# EAGLE design breadboard-small-with-header (EAGLE 6.5.0)
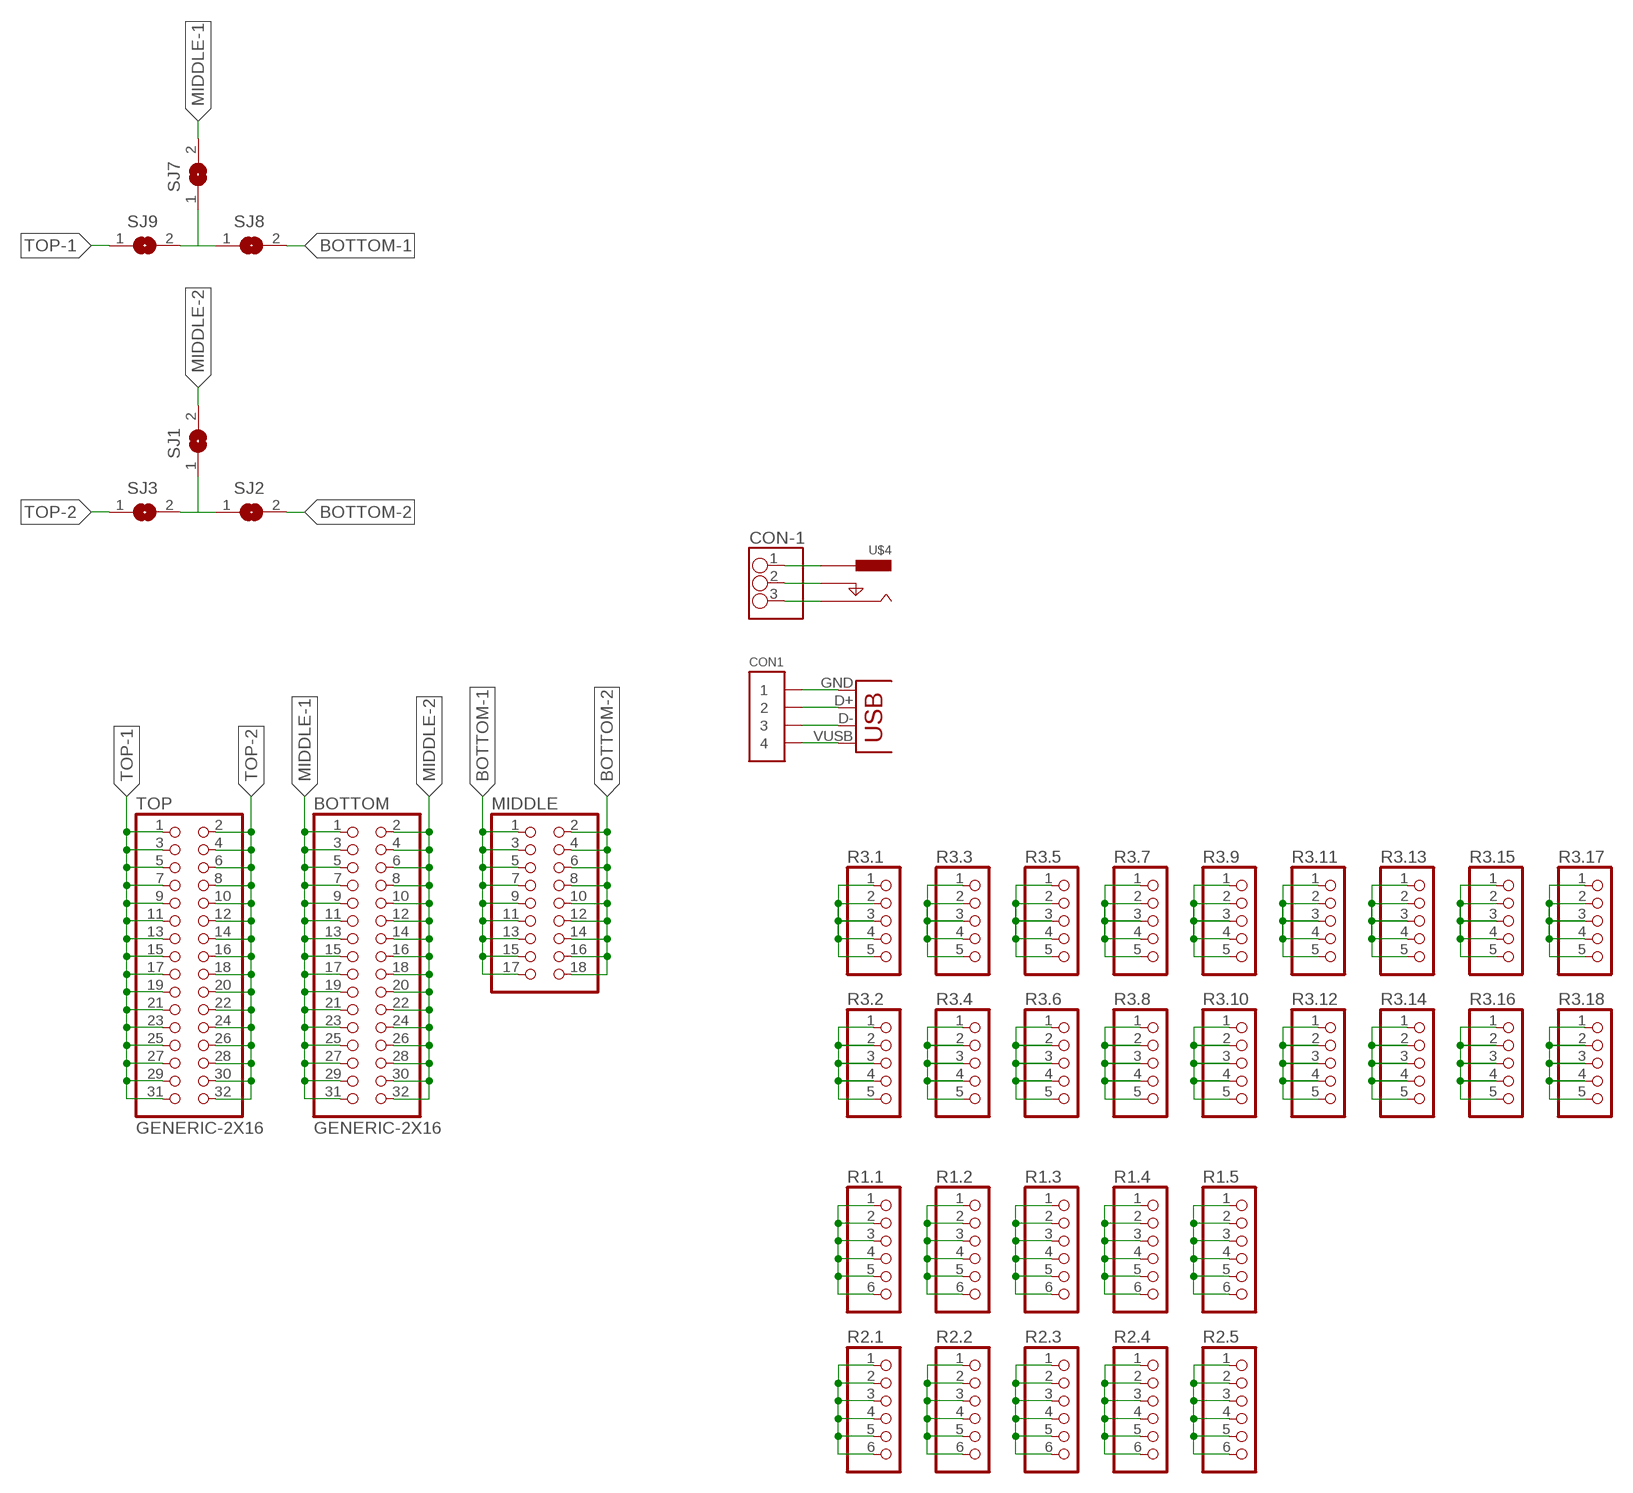
[diagram p0: schematic, sheet 1]

## Parts
BOTTOM  GENERIC-2X16  [PINHEADER-100MIL-2X16-NOSILK]
CON1  GENERIC-1X4STRAIGHT  [PINHEADER-100MIL-1X4-NOSILK]
CON-1  GENERIC-1X3  [PINHEADER-100MIL-1X3-NOSILK]
MIDDLE  GENERIC-2X9  [PINHEADER-100MIL-2X9-NOSILK]
R1.1  GENERIC-1X6  [PINHEADER-100MIL-1X6-NOSILK]
R1.2  GENERIC-1X6  [PINHEADER-100MIL-1X6-NOSILK]
R1.3  GENERIC-1X6  [PINHEADER-100MIL-1X6-NOSILK]
R1.4  GENERIC-1X6  [PINHEADER-100MIL-1X6-NOSILK]
R1.5  GENERIC-1X6  [PINHEADER-100MIL-1X6-NOSILK]
R2.1  GENERIC-1X6  [PINHEADER-100MIL-1X6-NOSILK]
R2.2  GENERIC-1X6  [PINHEADER-100MIL-1X6-NOSILK]
R2.3  GENERIC-1X6  [PINHEADER-100MIL-1X6-NOSILK]
R2.4  GENERIC-1X6  [PINHEADER-100MIL-1X6-NOSILK]
R2.5  GENERIC-1X6  [PINHEADER-100MIL-1X6-NOSILK]
R3.1  GENERIC-1X5  [PINHEADER-100MIL-1X5-NOSILK]
R3.2  GENERIC-1X5  [PINHEADER-100MIL-1X5-NOSILK]
R3.3  GENERIC-1X5  [PINHEADER-100MIL-1X5-NOSILK]
R3.4  GENERIC-1X5  [PINHEADER-100MIL-1X5-NOSILK]
R3.5  GENERIC-1X5  [PINHEADER-100MIL-1X5-NOSILK]
R3.6  GENERIC-1X5  [PINHEADER-100MIL-1X5-NOSILK]
R3.7  GENERIC-1X5  [PINHEADER-100MIL-1X5-NOSILK]
R3.8  GENERIC-1X5  [PINHEADER-100MIL-1X5-NOSILK]
R3.9  GENERIC-1X5  [PINHEADER-100MIL-1X5-NOSILK]
R3.10  GENERIC-1X5  [PINHEADER-100MIL-1X5-NOSILK]
R3.11  GENERIC-1X5  [PINHEADER-100MIL-1X5-NOSILK]
R3.12  GENERIC-1X5  [PINHEADER-100MIL-1X5-NOSILK]
R3.13  GENERIC-1X5  [PINHEADER-100MIL-1X5-NOSILK]
R3.14  GENERIC-1X5  [PINHEADER-100MIL-1X5-NOSILK]
R3.15  GENERIC-1X5  [PINHEADER-100MIL-1X5-NOSILK]
R3.16  GENERIC-1X5  [PINHEADER-100MIL-1X5-NOSILK]
R3.17  GENERIC-1X5  [PINHEADER-100MIL-1X5-NOSILK]
R3.18  GENERIC-1X5  [PINHEADER-100MIL-1X5-NOSILK]
SJ1  SJ  [SJ]
SJ2  SJ  [SJ]
SJ3  SJ  [SJ]
SJ7  SJ  [SJ]
SJ8  SJ  [SJ]
SJ9  SJ  [SJ]
TOP  GENERIC-2X16  [PINHEADER-100MIL-2X16-NOSILK]
U$3  USBMINI  [CONN_USB_MINI-B]
U$4  POWER-BARREL_JACKEBAY  [POWER-BARREL-2MM1-EBAY]

## Nets
BOTTOM-1: MIDDLE.1 MIDDLE.3 MIDDLE.5 MIDDLE.7 MIDDLE.9 MIDDLE.11 MIDDLE.13 MIDDLE.15 MIDDLE.17 SJ8.2
BOTTOM-2: MIDDLE.2 MIDDLE.4 MIDDLE.6 MIDDLE.8 MIDDLE.10 MIDDLE.12 MIDDLE.14 MIDDLE.16 MIDDLE.18 SJ2.2
CENTER: CON-1.1 U$4.P$4(CENTER)
MIDDLE-1: BOTTOM.1 BOTTOM.3 BOTTOM.5 BOTTOM.7 BOTTOM.9 BOTTOM.11 BOTTOM.13 BOTTOM.15 BOTTOM.17 BOTTOM.19 BOTTOM.21 BOTTOM.23 BOTTOM.25 BOTTOM.27 BOTTOM.29 BOTTOM.31 SJ7.2
MIDDLE-2: BOTTOM.2 BOTTOM.4 BOTTOM.6 BOTTOM.8 BOTTOM.10 BOTTOM.12 BOTTOM.14 BOTTOM.16 BOTTOM.18 BOTTOM.20 BOTTOM.22 BOTTOM.24 BOTTOM.26 BOTTOM.28 BOTTOM.30 BOTTOM.32 SJ1.2
N$1: R3.1.1 R3.1.2 R3.1.3 R3.1.4 R3.1.5
N$2: R3.2.1 R3.2.2 R3.2.3 R3.2.4 R3.2.5
N$10: R2.1.1 R2.1.2 R2.1.3 R2.1.4 R2.1.5 R2.1.6
N$11: R1.1.1 R1.1.2 R1.1.3 R1.1.4 R1.1.5 R1.1.6
N$12: R2.3.1 R2.3.2 R2.3.3 R2.3.4 R2.3.5 R2.3.6
N$13: R2.2.1 R2.2.2 R2.2.3 R2.2.4 R2.2.5 R2.2.6
N$14: R1.2.1 R1.2.2 R1.2.3 R1.2.4 R1.2.5 R1.2.6
N$15: R1.3.1 R1.3.2 R1.3.3 R1.3.4 R1.3.5 R1.3.6
N$16: R2.4.1 R2.4.2 R2.4.3 R2.4.4 R2.4.5 R2.4.6
N$17: R1.4.1 R1.4.2 R1.4.3 R1.4.4 R1.4.5 R1.4.6
N$18: R2.5.1 R2.5.2 R2.5.3 R2.5.4 R2.5.5 R2.5.6
N$19: R1.5.1 R1.5.2 R1.5.3 R1.5.4 R1.5.5 R1.5.6
N$20: R3.3.1 R3.3.2 R3.3.3 R3.3.4 R3.3.5
N$21: R3.4.1 R3.4.2 R3.4.3 R3.4.4 R3.4.5
N$22: R3.5.1 R3.5.2 R3.5.3 R3.5.4 R3.5.5
N$23: R3.6.1 R3.6.2 R3.6.3 R3.6.4 R3.6.5
N$24: R3.7.1 R3.7.2 R3.7.3 R3.7.4 R3.7.5
N$25: R3.8.1 R3.8.2 R3.8.3 R3.8.4 R3.8.5
N$26: R3.9.1 R3.9.2 R3.9.3 R3.9.4 R3.9.5
N$27: R3.10.1 R3.10.2 R3.10.3 R3.10.4 R3.10.5
N$28: R3.11.1 R3.11.2 R3.11.3 R3.11.4 R3.11.5
N$29: R3.12.1 R3.12.2 R3.12.3 R3.12.4 R3.12.5
N$30: R3.13.1 R3.13.2 R3.13.3 R3.13.4 R3.13.5
N$31: R3.14.1 R3.14.2 R3.14.3 R3.14.4 R3.14.5
N$32: R3.15.1 R3.15.2 R3.15.3 R3.15.4 R3.15.5
N$33: R3.16.1 R3.16.2 R3.16.3 R3.16.4 R3.16.5
N$34: R3.17.1 R3.17.2 R3.17.3 R3.17.4 R3.17.5
N$35: R3.18.1 R3.18.2 R3.18.3 R3.18.4 R3.18.5
N$36: SJ1.1 SJ2.1 SJ3.2
N$38: SJ7.1 SJ8.1 SJ9.2
SLEEVE: CON-1.3 U$4.P$3(OUTER)
SWITCH: CON-1.2 U$4.P$2(SWITCH)
TOP-1: SJ9.1 TOP.1 TOP.3 TOP.5 TOP.7 TOP.9 TOP.11 TOP.13 TOP.15 TOP.17 TOP.19 TOP.21 TOP.23 TOP.25 TOP.27 TOP.29 TOP.31
TOP-2: SJ3.1 TOP.2 TOP.4 TOP.6 TOP.8 TOP.10 TOP.12 TOP.14 TOP.16 TOP.18 TOP.20 TOP.22 TOP.24 TOP.26 TOP.28 TOP.30 TOP.32
USB-D+: CON1.2 U$3.D+
USB-DI: CON1.3 U$3.D-
USB-GND: CON1.1 U$3.GND
USB-V+: CON1.4 U$3.VUSB(VBUS)

## Library data of the parts
BOTTOM TOP = p.peter-connectors:GENERIC-2X16
CON1 = p.peter-connectors:GENERIC-1X4
CON-1 = p.peter-connectors:GENERIC-1X3
MIDDLE = p.peter-connectors:GENERIC-2X9
R1.1-R1.5 R2.1-R2.5 = p.peter-connectors:GENERIC-1X6
R3.1-R3.18 = p.peter-connectors:GENERIC-1X5
SJ1-SJ3 SJ7-SJ9 = jumper:SJ: SMD solder JUMPER
U$3 = p.peter-connectors:USB
U$4 = p.peter-connectors:POWER-BARREL_JACK

## Board
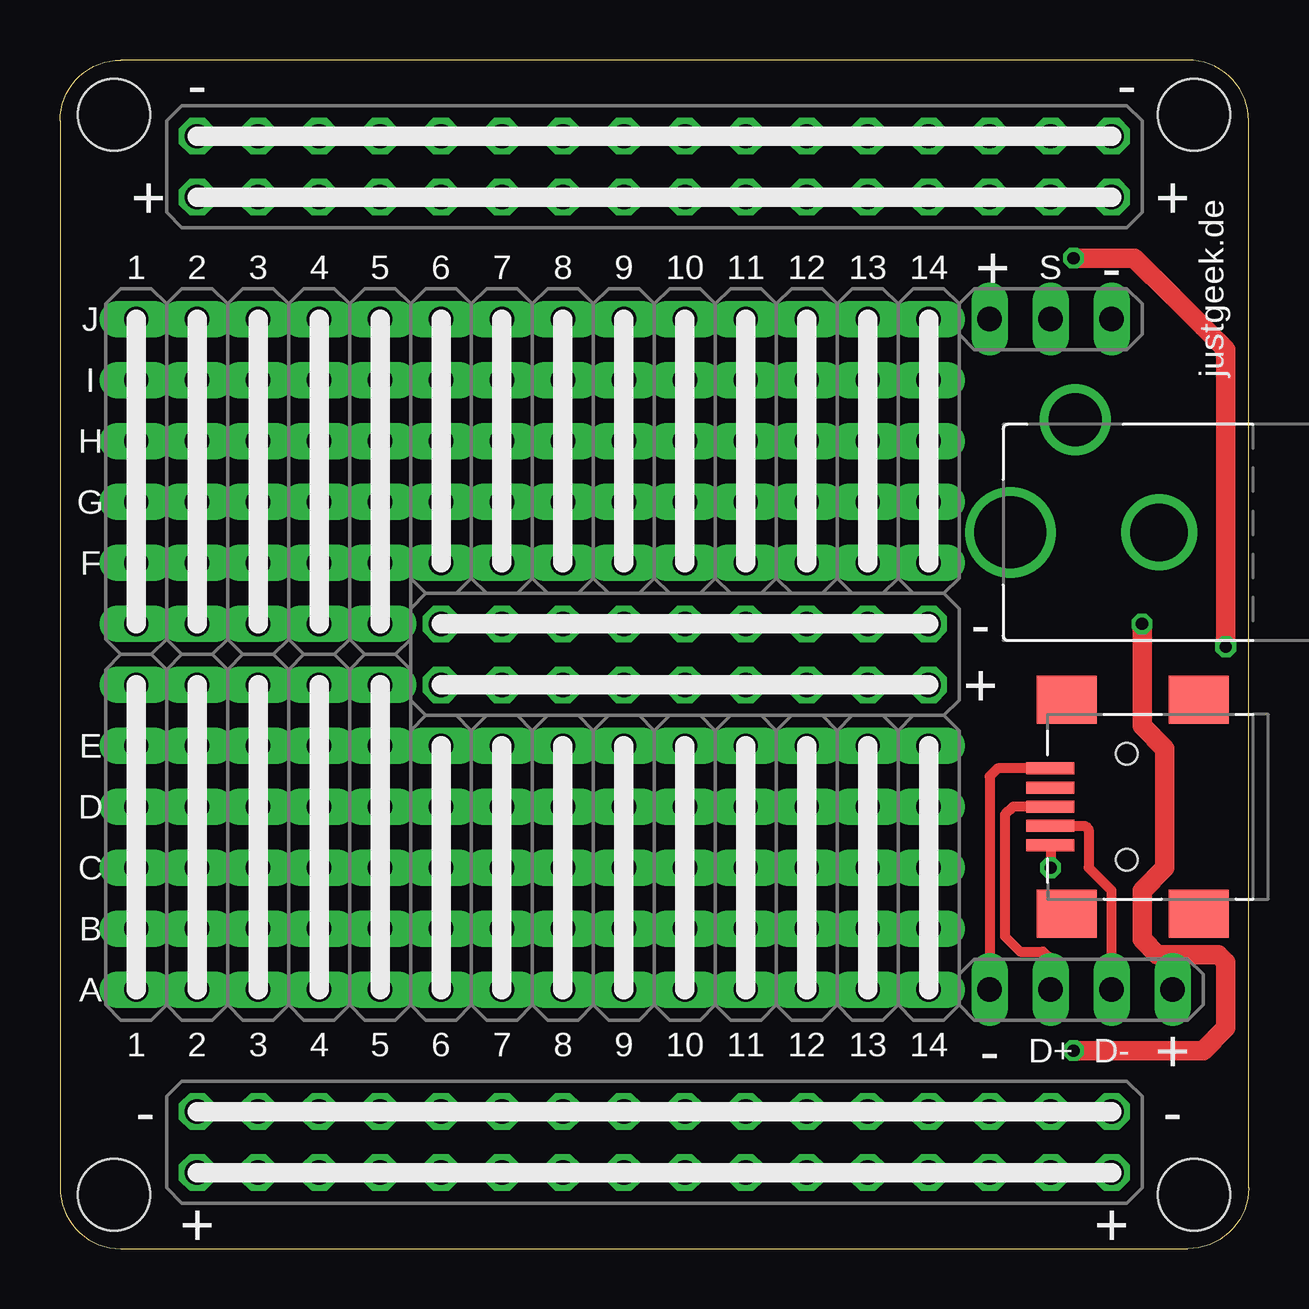
[diagram p1: board, top side]
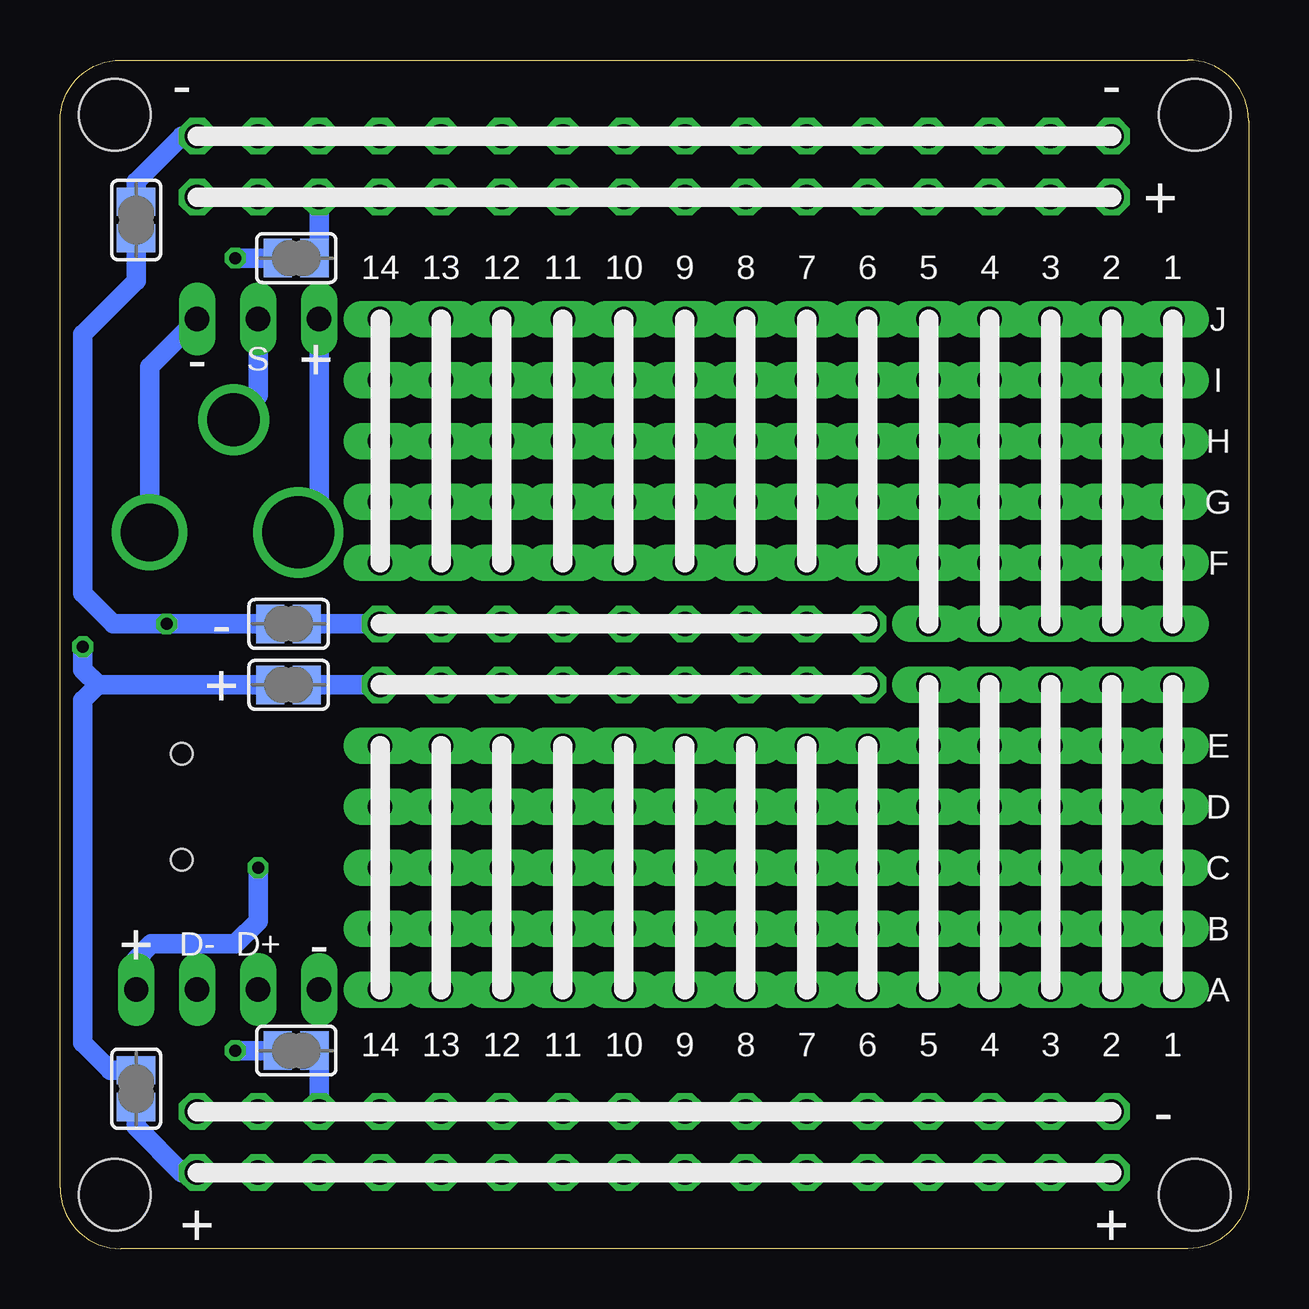
[diagram p2: board, bottom side, seen from below]

Size 49.53 x 49.53 mm. Coordinates in mm from the lower left corner, seen from the top.
Outline: 2.54,0 46.99,0 arc90 49.53,2.54 49.53,46.99 arc90 46.99,49.53 2.54,49.53 arc90 0,46.99 0,2.54 arc90 2.54,0
Copper layers (1*16): Top 0.0356mm / dielectric 1.5011mm / Bottom 0.0356mm
Design rules "oshpark *": minimum track width 6mil, minimum drill 13mil, track to track 6mil, track to pad 6mil, pad to pad 6mil, via to via 6mil, smd to smd 6mil, copper to edge 15mil, drill to drill 6mil, minimum pad ring 8mil, minimum via ring 7mil, stop-mask expansion 4mil, vias tented up to drill 4.1mm, thermal gap 10mil
Holes 3 mm at 2.25,47.25 47.25,47.25 2.25,2.25 47.25,2.25

### Footprints (pad centres in the part's own frame; a part is rotated, then mirrored left to right if it is on the bottom)
PINHEADER-100MIL-2X16-NOSILK = drill 1.016 octagon: 1 -19.05,-1.27; 2 -19.05,1.27; 3 -16.51,-1.27; 4 -16.51,1.27; 5 -13.97,-1.27; 6 -13.97,1.27; 7 -11.43,-1.27; 8 -11.43,1.27; 9 -8.89,-1.27; 10 -8.89,1.27; 11 -6.35,-1.27; 12 -6.35,1.27; 13 -3.81,-1.27; 14 -3.81,1.27; 15 -1.27,-1.27; 16 -1.27,1.27; 17 1.27,-1.27; 18 1.27,1.27; 19 3.81,-1.27; 20 3.81,1.27; 21 6.35,-1.27; 22 6.35,1.27; 23 8.89,-1.27; 24 8.89,1.27; 25 11.43,-1.27; 26 11.43,1.27; 27 13.97,-1.27; 28 13.97,1.27; 29 16.51,-1.27; 30 16.51,1.27; 31 19.05,-1.27; 32 19.05,1.27
PINHEADER-100MIL-1X4-NOSILK = drill 1.016 long: 1 -3.81,0; 2 -1.27,0; 3 1.27,0; 4 3.81,0
PINHEADER-100MIL-1X3-NOSILK = drill 1.016 long: 1 -2.54,0; 2 0,0; 3 2.54,0
PINHEADER-100MIL-2X9-NOSILK = drill 1.016 octagon: 1 -10.16,-1.27; 2 -10.16,1.27; 3 -7.62,-1.27; 4 -7.62,1.27; 5 -5.08,-1.27; 6 -5.08,1.27; 7 -2.54,-1.27; 8 -2.54,1.27; 9 0,-1.27; 10 0,1.27; 11 2.54,-1.27; 12 2.54,1.27; 13 5.08,-1.27; 14 5.08,1.27; 15 7.62,-1.27; 16 7.62,1.27; 17 10.16,-1.27; 18 10.16,1.27
PINHEADER-100MIL-1X6-NOSILK = drill 1.016 long: 1 -6.35,0; 2 -3.81,0; 3 -1.27,0; 4 1.27,0; 5 3.81,0; 6 6.35,0
PINHEADER-100MIL-1X5-NOSILK = drill 1.016 long: 1 -5.08,0; 2 -2.54,0; 3 0,0; 4 2.54,0; 5 5.08,0
SJ = smd 1.168 x 1.6: 1 -0.762,0; 2 0.762,0
CONN_USB_MINI-B = smd 2 x 2.5: BODY@1 -4.45,2.5; BODY@2 4.45,2.5; BODY@3 4.45,-3; BODY@4 -4.45,-3 | smd 0.5 x 2: D+ 0,3.2; D- -0.8,3.2; GND 1.6,3.2; ID 0.8,3.2; VUSB -1.6,3.2 | hole 0.9: -2.2,0; 2.2,0
POWER-BARREL-2MM1-EBAY = drill 2.2: P$2 0.5,-4.7 | drill 2.4: P$3 -3,0 | drill 3: P$4 3.2,0

### Placement (x,y rotation side)
BOTTOM  24.77,4.45 0 top
CON1  42.55,10.79 0 top
CON-1  41.27,38.73 0 top
MIDDLE  26.04,24.77 0 top
R1.1  3.17,32.38 90 top
R1.2  5.71,32.38 90 top
R1.3  8.26,32.38 90 top
R1.4  10.79,32.38 90 top
R1.5  13.34,32.38 90 top
R2.1  3.17,17.14 90 top
R2.2  5.71,17.14 90 top
R2.3  8.26,17.14 90 top
R2.4  10.79,17.14 90 top
R2.5  13.34,17.14 90 top
R3.1  15.88,33.66 90 top
R3.2  15.88,15.88 90 top
R3.3  18.41,33.66 90 top
R3.4  18.41,15.88 90 top
R3.5  20.95,33.66 90 top
R3.6  20.95,15.88 90 top
R3.7  23.5,33.66 90 top
R3.8  23.5,15.88 90 top
R3.9  26.04,33.66 90 top
R3.10  26.04,15.88 90 top
R3.11  28.57,33.66 90 top
R3.12  28.57,15.88 90 top
R3.13  31.11,33.66 90 top
R3.14  31.11,15.88 90 top
R3.15  33.66,33.66 90 top
R3.16  33.66,15.88 90 top
R3.17  36.2,33.66 90 top
R3.18  36.2,15.88 90 top
SJ1  39.69,8.26 0 bottom
SJ2  40.01,26.04 0 bottom
SJ3  46.35,42.86 270 bottom
SJ7  46.35,6.67 270 bottom
SJ8  40.01,23.5 0 bottom
SJ9  39.69,41.27 180 bottom
TOP  24.77,45.09 0 top
U$3  44.45,18.41 90 top
U$4  42.8,29.84 180 top

### Tracks (layer width: path | path; a pad name or v marks a point on that pad's centre or on a via)
BOTTOM-1
  Bottom 0.813: SJ8.2 MIDDLE.17 MIDDLE.15 MIDDLE.13 MIDDLE.11 MIDDLE.9 MIDDLE.7 MIDDLE.5 MIDDLE.3 MIDDLE.1
BOTTOM-2
  Bottom 0.813: SJ2.2 MIDDLE.18 MIDDLE.16 MIDDLE.14 MIDDLE.12 MIDDLE.10 MIDDLE.8 MIDDLE.6 MIDDLE.4 MIDDLE.2
CENTER
  Bottom 0.813: U$4.P$4 39.69,29.84 38.73,30.8 CON-1.1
MIDDLE-1
  Bottom 0.813: SJ7.2 46.35,5.08 44.45,3.17 BOTTOM.31 BOTTOM.29 BOTTOM.27 BOTTOM.25 BOTTOM.23 BOTTOM.21 BOTTOM.19 BOTTOM.17 BOTTOM.15 BOTTOM.13 BOTTOM.11 BOTTOM.9 BOTTOM.7 BOTTOM.5 BOTTOM.3 BOTTOM.1
MIDDLE-2
  Bottom 0.813: BOTTOM.32 41.59,5.71 BOTTOM.30 BOTTOM.28 | BOTTOM.28 38.73,8.06 SJ1.2 | BOTTOM.2 BOTTOM.4 BOTTOM.6 BOTTOM.8 BOTTOM.10 BOTTOM.12 BOTTOM.14 BOTTOM.16 BOTTOM.18 BOTTOM.20 BOTTOM.22 BOTTOM.24 BOTTOM.26 BOTTOM.28
N$1
  Bottom 0.813: R3.1.5 R3.1.4 R3.1.3 R3.1.2 R3.1.1
N$2
  Bottom 0.813: R3.2.1 R3.2.2 R3.2.3 R3.2.4 R3.2.5
N$10
  Bottom 0.813: R2.1.6 R2.1.5 R2.1.4 R2.1.3 R2.1.2 R2.1.1
N$11
  Bottom 0.813: R1.1.6 R1.1.5 R1.1.4 R1.1.3 R1.1.2 R1.1.1
N$12
  Bottom 0.813: R2.3.6 R2.3.5 R2.3.4 R2.3.3 R2.3.2 R2.3.1
N$13
  Bottom 0.813: R2.2.6 R2.2.5 R2.2.4 R2.2.3 R2.2.2 R2.2.1
N$14
  Bottom 0.813: R1.2.6 R1.2.5 R1.2.4 R1.2.3 R1.2.2 R1.2.1
N$15
  Bottom 0.813: R1.3.6 R1.3.5 R1.3.4 R1.3.3 R1.3.2 R1.3.1
N$16
  Bottom 0.813: R2.4.6 R2.4.5 R2.4.4 R2.4.3 R2.4.2 R2.4.1
N$17
  Bottom 0.813: R1.4.6 R1.4.5 R1.4.4 R1.4.3 R1.4.2 R1.4.1
N$18
  Bottom 0.813: R2.5.6 R2.5.5 R2.5.4 R2.5.3 R2.5.2 R2.5.1
N$19
  Bottom 0.813: R1.5.6 R1.5.5 R1.5.4 R1.5.3 R1.5.2 R1.5.1
N$20
  Bottom 0.813: R3.3.1 R3.3.2 R3.3.3 R3.3.4 R3.3.5
N$21
  Bottom 0.813: R3.4.1 R3.4.2 R3.4.3 R3.4.4 R3.4.5
N$22
  Bottom 0.813: R3.5.1 R3.5.2 R3.5.3 R3.5.4 R3.5.5
N$23
  Bottom 0.813: R3.6.1 R3.6.2 R3.6.3 R3.6.4 R3.6.5
N$24
  Bottom 0.813: R3.7.1 R3.7.2 R3.7.3 R3.7.4 R3.7.5
N$25
  Bottom 0.813: R3.8.1 R3.8.2 R3.8.3 R3.8.4 R3.8.5
N$26
  Bottom 0.813: R3.9.1 R3.9.2 R3.9.3 R3.9.4 R3.9.5
N$27
  Bottom 0.813: R3.10.1 R3.10.2 R3.10.3 R3.10.4 R3.10.5
N$28
  Bottom 0.813: R3.11.1 R3.11.2 R3.11.3 R3.11.4 R3.11.5
N$29
  Bottom 0.813: R3.12.1 R3.12.2 R3.12.3 R3.12.4 R3.12.5
N$30
  Bottom 0.813: R3.13.1 R3.13.2 R3.13.3 R3.13.4 R3.13.5
N$31
  Bottom 0.813: R3.14.1 R3.14.2 R3.14.3 R3.14.4 R3.14.5
N$32
  Bottom 0.813: R3.15.1 R3.15.2 R3.15.3 R3.15.4 R3.15.5
N$33
  Bottom 0.813: R3.16.1 R3.16.2 R3.16.3 R3.16.4 R3.16.5
N$34
  Bottom 0.813: R3.17.1 R3.17.2 R3.17.3 R3.17.4 R3.17.5
N$35
  Bottom 0.813: R3.18.1 R3.18.2 R3.18.3 R3.18.4 R3.18.5
N$36  (via drill 0.51)
  Top 0.813: v42.23,8.26 47.62,8.26 48.58,9.21 48.58,11.94 48.26,12.26 45.72,12.26 45.09,12.89 45.09,14.92 46.04,15.88 46.04,20.83 45.09,21.78 v45.09,26.04
  Bottom 0.813: SJ3.2 46.35,40.32 48.58,38.1 48.58,27.3 47.31,26.04 v45.09,26.04 SJ2.1 | SJ1.1 v42.23,8.26
N$38  (via drill 0.51)
  Top 0.813: v42.23,41.27 44.77,41.27 46.35,39.69 47.62,38.42 48.26,37.78 48.58,37.47 v48.58,25.08
  Bottom 0.813: SJ7.1 47.43,7.43 48.58,8.57 48.58,22.86 47.94,23.5 | 47.94,23.5 40.96,23.5 SJ8.1 | SJ9.2 v42.23,41.27 | v48.58,25.08 48.58,24.13 47.94,23.5
SLEEVE
  Bottom 0.813: CON-1.3 45.8,36.75 U$4.P$3
SWITCH
  Bottom 0.813: U$4.P$2 41.27,35.57 CON-1.2
TOP-1
  Bottom 0.813: SJ9.1 38.73,41.27 TOP.27 | TOP.27 TOP.29 TOP.31 | TOP.1 TOP.3 TOP.5 TOP.7 TOP.9 TOP.11 TOP.13 TOP.15 TOP.17 TOP.19 TOP.21 TOP.23 TOP.25 TOP.27
TOP-2
  Bottom 0.813: SJ3.1 46.35,44.45 44.45,46.35 TOP.32 TOP.30 TOP.28 TOP.26 TOP.24 TOP.22 TOP.20 TOP.18 TOP.16 TOP.14 TOP.12 TOP.10 TOP.8 TOP.6 TOP.4 TOP.2
USB-D+
  Top 0.406: U$3.D+ 39.69,18.41 39.37,18.1 39.37,13.02 40.01,12.38 40.96,12.38 41.27,12.06 CON1.2
USB-DI
  Top 0.406: CON1.3 43.81,14.92 43.18,15.56 42.86,15.88 42.86,17.46 42.71,17.61 U$3.D-
USB-GND
  Top 0.406: U$3.GND 39.06,20.02 38.73,19.68 CON1.1
USB-V+  (via drill 0.51)
  Top 0.406: U$3.VUSB 41.26,16.82 41.27,16.83 41.27,16.19 v41.27,15.88
  Bottom 0.813: v41.27,15.88 41.27,13.65 42.23,12.7 45.72,12.7 46.35,12.06 CON1.4

### Text on the board
tPlace: - | - | + | + | 1 | 2 | 3 | 4 | 5 | 6 | 7 | 8 | 9 | 10 | 11 | 12 | 13 | 14 | + | S | - | justgeek.de | J | I | H | G | F | - | + | E | D | C | B | A | 1 | 2 | 3 | 4 | 5 | 6 | 7 | 8 | 9 | 10 | 11 | 12 | 13 | 14 | - | D+ | D- | + | - | - | + | +
bPlace: - | - | + | 1 | 2 | 3 | 4 | 5 | 6 | 7 | 8 | 9 | 10 | 11 | 12 | 13 | 14 | J | + | S | - | I | H | G | F | - | + | E | D | C | B | - | D+ | D- | + | A | 1 | 2 | 3 | 4 | 5 | 6 | 7 | 8 | 9 | 10 | 11 | 12 | 13 | 14 | - | + | +